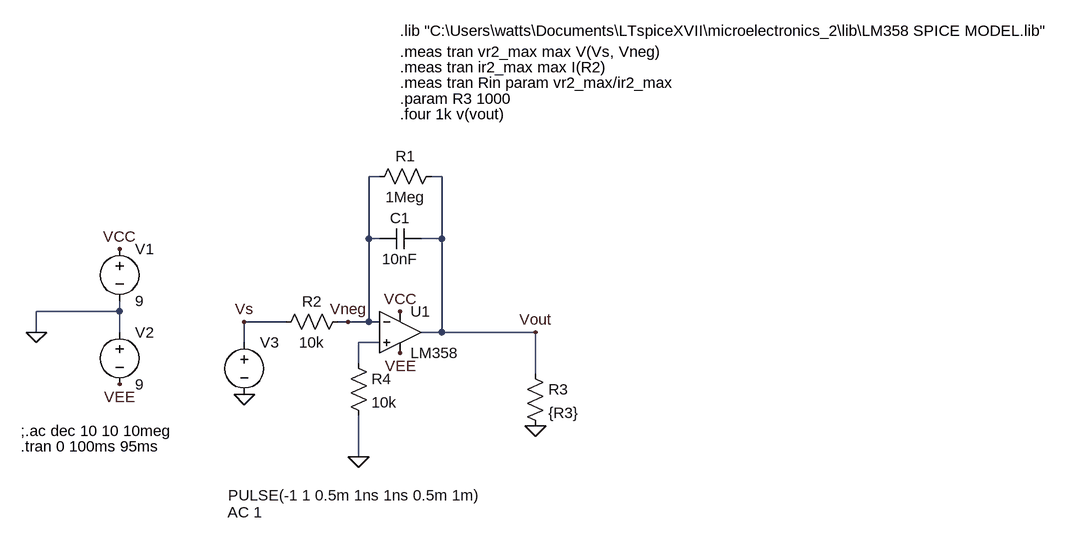
[diagram p0: schematic integrator.asc]
integrator.asc, the LTspice schematic file:
Version 4
SHEET 1 1376 808
WIRE 224 96 208 96
WIRE 320 96 304 96
WIRE 208 192 208 96
WIRE 224 192 208 192
WIRE 320 192 320 96
WIRE 320 192 288 192
WIRE -176 304 -176 288
WIRE -176 304 -304 304
WIRE 80 320 16 320
WIRE 176 320 160 320
WIRE 208 320 208 192
WIRE 208 320 176 320
WIRE 224 320 208 320
WIRE -304 336 -304 304
WIRE -176 336 -176 304
WIRE 320 336 320 192
WIRE 320 336 288 336
WIRE 464 336 320 336
WIRE 16 352 16 320
WIRE 224 352 192 352
WIRE 192 384 192 352
WIRE 464 400 464 336
WIRE 192 528 192 464
FLAG -304 336 0
FLAG -176 208 VCC
FLAG -176 416 VEE
FLAG 256 304 VCC
FLAG 256 368 VEE
FLAG 16 432 0
FLAG 464 480 0
FLAG 464 336 Vout
FLAG 16 320 Vs
FLAG 176 320 Vneg
FLAG 192 528 0
SYMBOL OpAmps\\opamp2 256 272 R0
SYMATTR InstName U1
SYMATTR Value LM358
SYMBOL res 64 336 R270
WINDOW 0 32 56 VTop 2
WINDOW 3 0 56 VBottom 2
SYMATTR InstName R2
SYMATTR Value 10k
SYMBOL voltage -176 192 R0
WINDOW 123 0 0 Left 0
WINDOW 39 0 0 Left 0
SYMATTR InstName V1
SYMATTR Value 9
SYMBOL voltage -176 320 R0
WINDOW 123 0 0 Left 0
WINDOW 39 0 0 Left 0
SYMATTR InstName V2
SYMATTR Value 9
SYMBOL voltage 16 336 R0
WINDOW 123 -26 277 Left 2
WINDOW 39 0 0 Left 0
WINDOW 3 -25 251 Left 2
SYMATTR Value2 AC 1
SYMATTR Value PULSE(-1 1 0.5m 1ns 1ns 0.5m 1m)
SYMATTR InstName V3
SYMBOL res 448 384 R0
SYMATTR InstName R3
SYMATTR Value {R3}
SYMBOL cap 288 176 R90
WINDOW 0 0 32 VBottom 2
WINDOW 3 32 32 VTop 2
SYMATTR InstName C1
SYMATTR Value 10nF
SYMBOL res 320 80 R90
WINDOW 0 0 56 VBottom 2
WINDOW 3 32 56 VTop 2
SYMATTR InstName R1
SYMATTR Value 1Meg
SYMBOL res 176 368 R0
SYMATTR InstName R4
SYMATTR Value 10k
TEXT 256 -128 Left 2 !.lib "C:\\Users\\watts\\Documents\\LTspiceXVII\\microelectronics_2\\lib\\LM358 SPICE MODEL.lib"
TEXT -328 512 Left 2 !.tran 0 100ms 95ms
TEXT 256 -96 Left 2 !.meas tran vr2_max max V(Vs, Vneg)
TEXT 256 -72 Left 2 !.meas tran ir2_max max I(R2)
TEXT 256 -48 Left 2 !.meas tran Rin param vr2_max/ir2_max
TEXT 256 0 Left 2 !.four 1k v(vout)
TEXT 256 -24 Left 2 !.param R3 1000
TEXT -328 488 Left 2 !;.ac dec 10 10 10meg

The netlist it stands for:
* integrator.asc
XU1 N001 Vneg VCC VEE Vout LM358  ; pins In+ In- V+ V- OUT
R2 Vs Vneg 10k
V1 VCC 0 9
V2 0 VEE 9
V3 Vs 0 PULSE(-1 1 0.5m 1ns 1ns 0.5m 1m) AC 1
R3 Vout 0 {R3}
C1 Vout Vneg 10nF
R1 Vout Vneg 1Meg
R4 N001 0 10k
.lib "C:\Users\watts\Documents\LTspiceXVII\microelectronics_2\lib\LM358 SPICE MODEL.lib"
.tran 0 100ms 95ms
.meas tran vr2_max max V(Vs, Vneg)
.meas tran ir2_max max I(R2)
.meas tran Rin param vr2_max/ir2_max
.four 1k v(vout)
.param R3 1000
;.ac dec 10 10 10meg
.backanno
.end